# Altium schematic sheet tms320f28388d_core_board_a.SchDoc
size A3; SheetNumber: 1; SheetTotal: 3
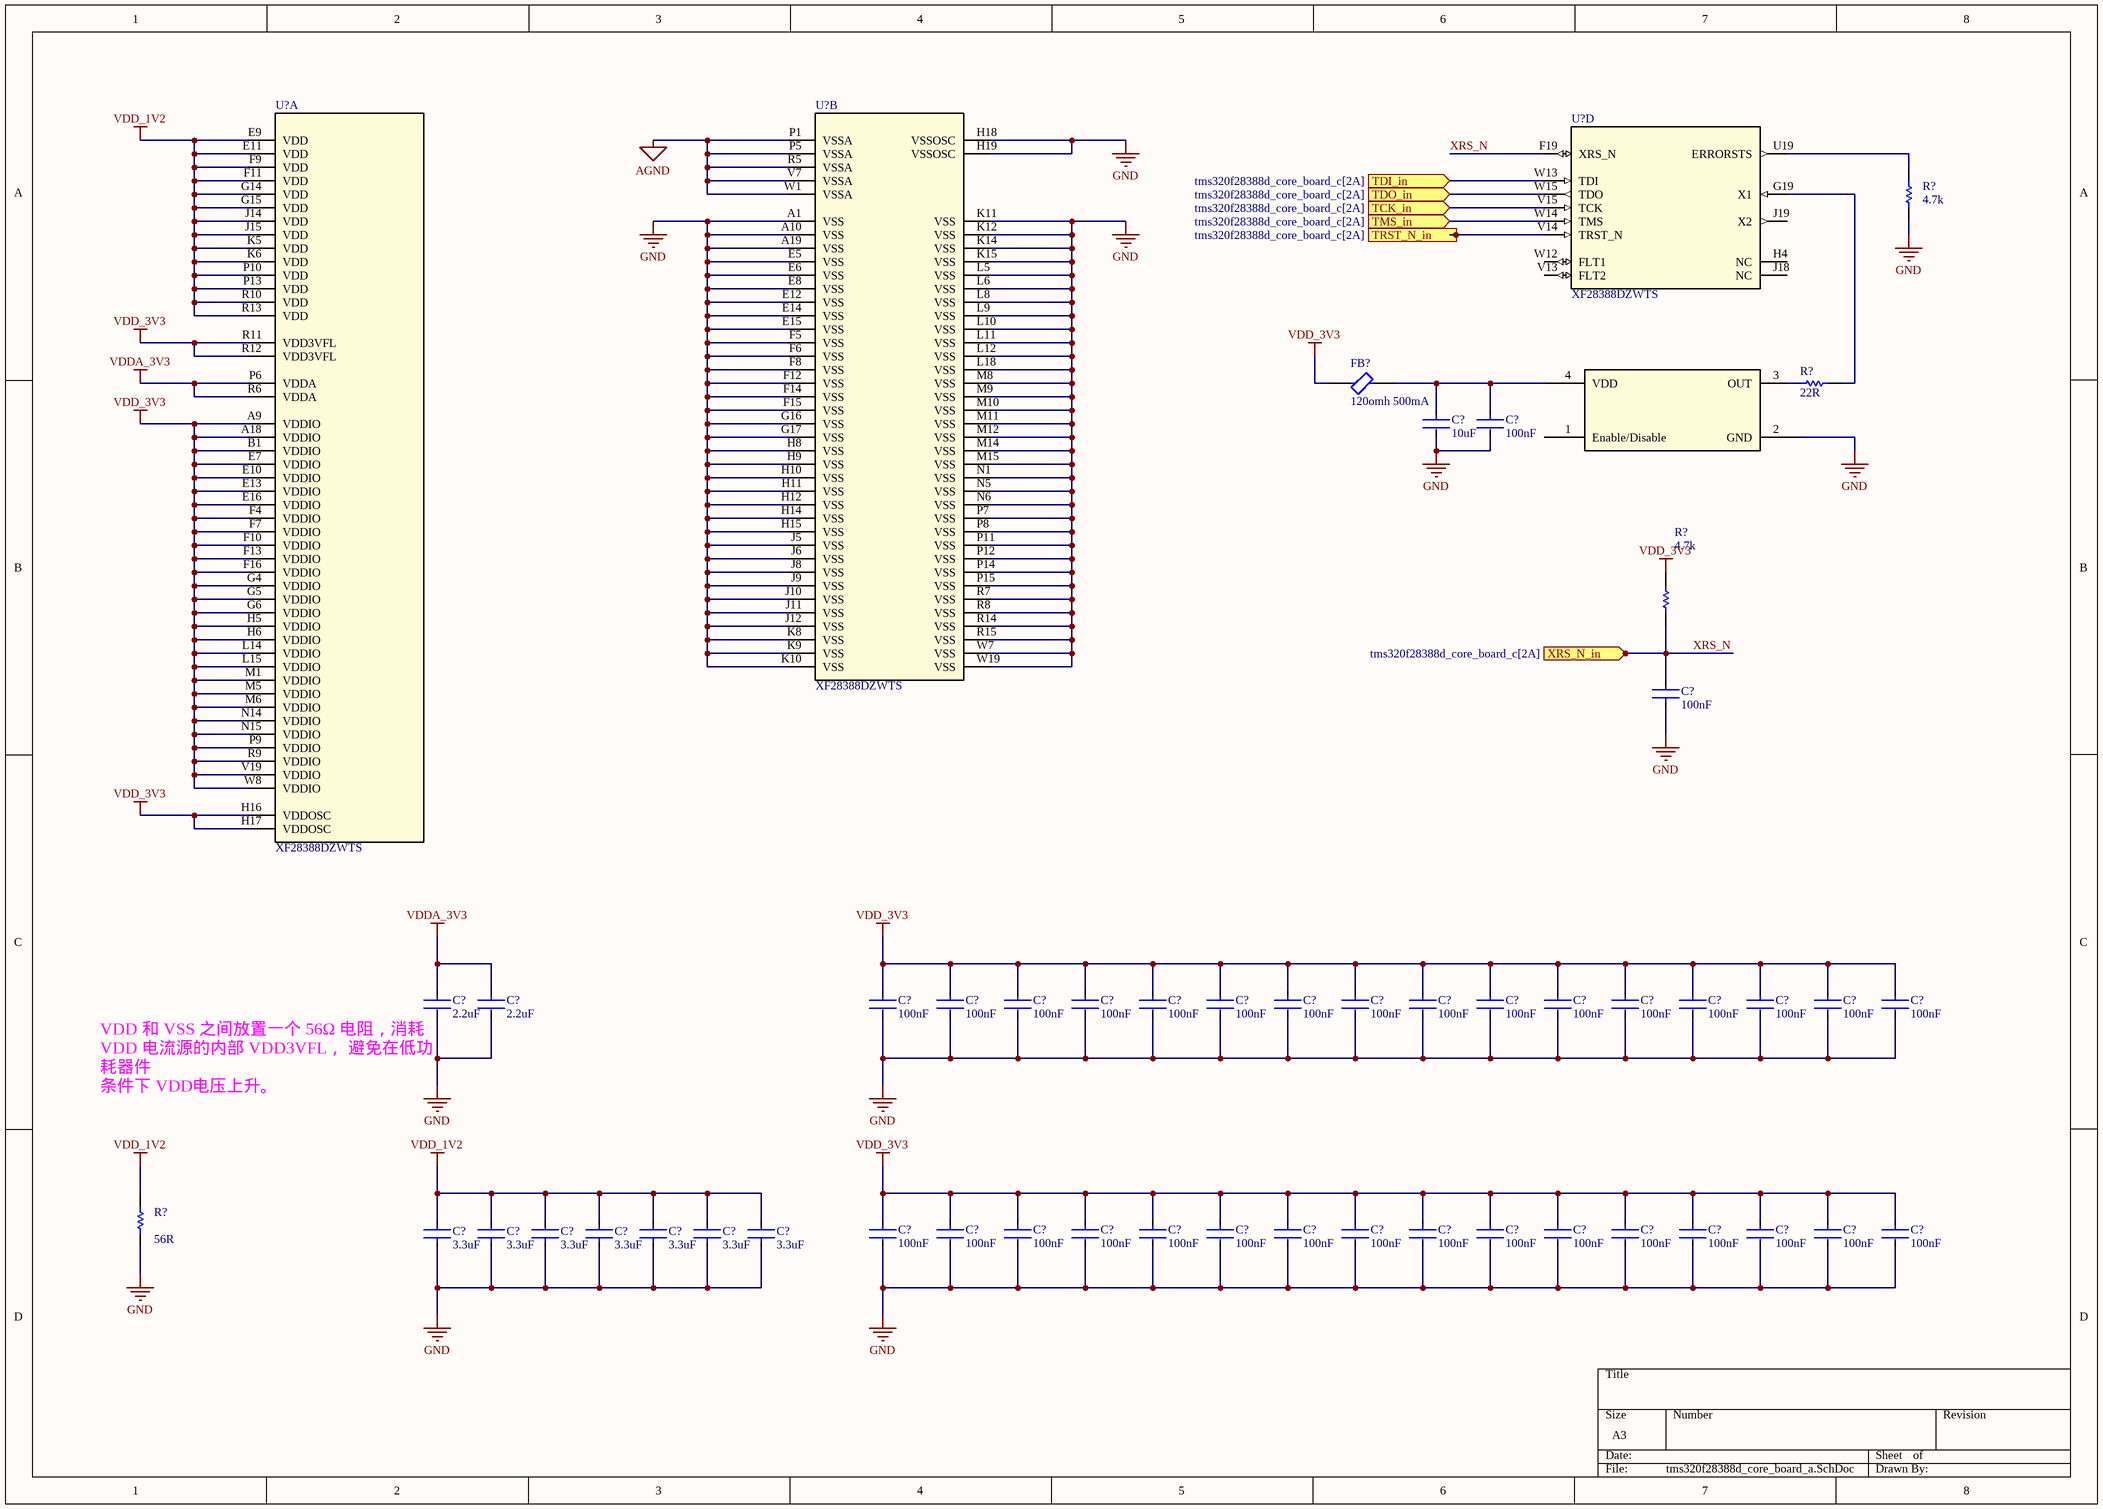
[diagram p0: tms320f28388d_core_board_a.SchDoc]

## Parts
(Parts that share a designator on the sheet are numbered #1, #2 ... from top to bottom, then left to right.)
C?#1  10uF  [FP-CC0402-MFG]
C?#2  100nF  [FP-CC0402-MFG]
C?#3  100nF  [FP-CC0402-MFG]
C?#4  2.2uF  [FP-CC0402-MFG]
C?#5  2.2uF  [FP-CC0402-MFG]
C?#6  100nF  [FP-CC0402-MFG]
C?#7  100nF  [FP-CC0402-MFG]
C?#8  100nF  [FP-CC0402-MFG]
C?#9  100nF  [FP-CC0402-MFG]
C?#10  100nF  [FP-CC0402-MFG]
C?#11  100nF  [FP-CC0402-MFG]
C?#12  100nF  [FP-CC0402-MFG]
C?#13  100nF  [FP-CC0402-MFG]
C?#14  100nF  [FP-CC0402-MFG]
C?#15  100nF  [FP-CC0402-MFG]
C?#16  100nF  [FP-CC0402-MFG]
C?#17  100nF  [FP-CC0402-MFG]
C?#18  100nF  [FP-CC0402-MFG]
C?#19  100nF  [FP-CC0402-MFG]
C?#20  100nF  [FP-CC0402-MFG]
C?#21  100nF  [FP-CC0402-MFG]
C?#22  100nF  [FP-CC0402-MFG]
C?#23  100nF  [FP-CC0402-MFG]
C?#24  100nF  [FP-CC0402-MFG]
C?#25  100nF  [FP-CC0402-MFG]
C?#26  100nF  [FP-CC0402-MFG]
C?#27  100nF  [FP-CC0402-MFG]
C?#28  100nF  [FP-CC0402-MFG]
C?#29  100nF  [FP-CC0402-MFG]
C?#30  100nF  [FP-CC0402-MFG]
C?#31  100nF  [FP-CC0402-MFG]
C?#32  100nF  [FP-CC0402-MFG]
C?#33  100nF  [FP-CC0402-MFG]
C?#34  100nF  [FP-CC0402-MFG]
C?#35  100nF  [FP-CC0402-MFG]
C?#36  100nF  [FP-CC0402-MFG]
C?#37  100nF  [FP-CC0402-MFG]
C?#38  3.3uF  [FP-CC0402-MFG]
C?#39  3.3uF  [FP-CC0402-MFG]
C?#40  3.3uF  [FP-CC0402-MFG]
C?#41  3.3uF  [FP-CC0402-MFG]
C?#42  3.3uF  [FP-CC0402-MFG]
C?#43  3.3uF  [FP-CC0402-MFG]
C?#44  3.3uF  [FP-CC0402-MFG]
FB?  120omh 500mA  [FP-MMZ1005-MFG]
R?#1  4.7k  [FP-RT0402-MFG]
R?#2  22R  [FP-RC0402-0_4-IPC_A]
R?#3  4.7k  [FP-RT0402-MFG]
R?#4  56R  [FP-RT0402-MFG]
U?#1  XF28388DZWTS  [ZWT0337A-MFG]  (part A of 8)
U?#2  XF28388DZWTS  [ZWT0337A-MFG]  (part B of 8)
U?#3  XF28388DZWTS  [ZWT0337A-MFG]  (part D of 8)
X??  ot252020mjba4sl  [OSC-SMD_4P-L2.5-W2.0-BL]  (value not drawn)

## Ports
TCK_in (in, see tms320f28388d_core_board_c[2A]), TDI_in (in, see tms320f28388d_core_board_c[2A]), TDO_in (in, see tms320f28388d_core_board_c[2A]), TMS_in (in, see tms320f28388d_core_board_c[2A]), TRST_N_in (in, see tms320f28388d_core_board_c[2A]), XRS_N_in (in, see tms320f28388d_core_board_c[2A])

## Nets
AGND: U?#2.P1(VSSA) U?#2.P5(VSSA) U?#2.R5(VSSA) U?#2.V7(VSSA) U?#2.W1(VSSA)
GND: C?#1.2 C?#2.2 C?#3.1 C?#4.2 C?#5.2 C?#6.2 C?#7.2 C?#8.2 C?#9.2 C?#10.2 C?#11.2 C?#12.2 C?#13.2 C?#14.2 C?#15.2 C?#16.2 C?#17.2 C?#18.2 C?#19.2 C?#20.2 C?#21.2 C?#22.2 C?#23.2 C?#24.2 C?#25.2 C?#26.2 C?#27.2 C?#28.2 C?#29.2 C?#30.2 C?#31.2 C?#32.2 C?#33.2 C?#34.2 C?#35.2 C?#36.2 C?#37.2 C?#38.1 C?#39.1 C?#40.1 C?#41.1 C?#42.1 C?#43.1 C?#44.1 R?#1.2 R?#4.2 U?#2.A1(VSS) U?#2.A10(VSS) U?#2.A19(VSS) U?#2.E5(VSS) U?#2.E6(VSS) U?#2.E8(VSS) U?#2.E12(VSS) U?#2.E14(VSS) U?#2.E15(VSS) U?#2.F5(VSS) U?#2.F6(VSS) U?#2.F8(VSS) U?#2.F12(VSS) U?#2.F14(VSS) U?#2.F15(VSS) U?#2.G16(VSS) U?#2.G17(VSS) U?#2.H8(VSS) U?#2.H9(VSS) U?#2.H10(VSS) U?#2.H11(VSS) U?#2.H12(VSS) U?#2.H14(VSS) U?#2.H15(VSS) U?#2.H18(VSSOSC) U?#2.H19(VSSOSC) U?#2.J5(VSS) U?#2.J6(VSS) U?#2.J8(VSS) U?#2.J9(VSS) U?#2.J10(VSS) U?#2.J11(VSS) U?#2.J12(VSS) U?#2.K8(VSS) U?#2.K9(VSS) U?#2.K10(VSS) U?#2.K11(VSS) U?#2.K12(VSS) U?#2.K14(VSS) U?#2.K15(VSS) U?#2.L5(VSS) U?#2.L6(VSS) U?#2.L8(VSS) U?#2.L9(VSS) U?#2.L10(VSS) U?#2.L11(VSS) U?#2.L12(VSS) U?#2.L18(VSS) U?#2.M8(VSS) U?#2.M9(VSS) U?#2.M10(VSS) U?#2.M11(VSS) U?#2.M12(VSS) U?#2.M14(VSS) U?#2.M15(VSS) U?#2.N1(VSS) U?#2.N5(VSS) U?#2.N6(VSS) U?#2.P7(VSS) U?#2.P8(VSS) U?#2.P11(VSS) U?#2.P12(VSS) U?#2.P14(VSS) U?#2.P15(VSS) U?#2.R7(VSS) U?#2.R8(VSS) U?#2.R14(VSS) U?#2.R15(VSS) U?#2.W7(VSS) U?#2.W19(VSS) X??.2(GND)
VDD_1V2: C?#38.2 C?#39.2 C?#40.2 C?#41.2 C?#42.2 C?#43.2 C?#44.2 R?#4.1 U?#1.E9(VDD) U?#1.E11(VDD) U?#1.F9(VDD) U?#1.F11(VDD) U?#1.G14(VDD) U?#1.G15(VDD) U?#1.J14(VDD) U?#1.J15(VDD) U?#1.K5(VDD) U?#1.K6(VDD) U?#1.P10(VDD) U?#1.P13(VDD) U?#1.R10(VDD) U?#1.R13(VDD)
VDD_3V3: C?#6.1 C?#7.1 C?#8.1 C?#9.1 C?#10.1 C?#11.1 C?#12.1 C?#13.1 C?#14.1 C?#15.1 C?#16.1 C?#17.1 C?#18.1 C?#19.1 C?#20.1 C?#21.1 C?#22.1 C?#23.1 C?#24.1 C?#25.1 C?#26.1 C?#27.1 C?#28.1 C?#29.1 C?#30.1 C?#31.1 C?#32.1 C?#33.1 C?#34.1 C?#35.1 C?#36.1 C?#37.1 FB?.1 R?#3.1 U?#1.A9(VDDIO) U?#1.A18(VDDIO) U?#1.B1(VDDIO) U?#1.E7(VDDIO) U?#1.E10(VDDIO) U?#1.E13(VDDIO) U?#1.E16(VDDIO) U?#1.F4(VDDIO) U?#1.F7(VDDIO) U?#1.F10(VDDIO) U?#1.F13(VDDIO) U?#1.F16(VDDIO) U?#1.G4(VDDIO) U?#1.G5(VDDIO) U?#1.G6(VDDIO) U?#1.H5(VDDIO) U?#1.H6(VDDIO) U?#1.H16(VDDOSC) U?#1.H17(VDDOSC) U?#1.L14(VDDIO) U?#1.L15(VDDIO) U?#1.M1(VDDIO) U?#1.M5(VDDIO) U?#1.M6(VDDIO) U?#1.N14(VDDIO) U?#1.N15(VDDIO) U?#1.P9(VDDIO) U?#1.R9(VDDIO) U?#1.R11(VDD3VFL) U?#1.R12(VDD3VFL) U?#1.V19(VDDIO) U?#1.W8(VDDIO)
VDDA_3V3: C?#4.1 C?#5.1 U?#1.P6(VDDA) U?#1.R6(VDDA)
TCK_in: U?#3.V15(TCK) ; port TCK_in
TDI_in: U?#3.W13(TDI) ; port TDI_in
TDO_in: U?#3.W15(TDO) ; port TDO_in
TMS_in: U?#3.W14(TMS) ; port TMS_in
TRST_N_in: U?#3.V14(TRST_N) ; port TRST_N_in
XRS_N: C?#3.2 R?#3.2 U?#3.F19(XRS_N) ; port XRS_N_in
NetC?#1_1: C?#1.1 C?#2.1 FB?.2 X??.4(VDD)
NetR?#1_1: R?#1.1 U?#3.U19(ERRORSTS)
NetR?#2_1: R?#2.1 X??.3(OUT)
NetR?#2_2: R?#2.2 U?#3.G19(X1)

Not connected (* = marked no-connect by the designer): U?#3 H4(NC) J18(NC) J19(X2) V13(FLT2) W12(FLT1); X?? 1(Enable/Disable)

## Notes on the sheet
- (near C?#4) VDD 和 VSS 之间放置一个 56Ω 电阻，消耗 VDD 电流源的内部 VDD3VFL， 避免在低功耗器件
  条件下 VDD电压上升。

## Library data of the parts
C?#1 = CL05A106MP5NUNC: CAP CER 10UF 10V X5R 0402; Manufacturer: Samsung; Temperature Coefficient: 15%; Tolerance: 20%; Material: Ceramic; Octopart: https://octopart.com/cl05a106mp5nunc-samsung-22457395; Voltage Rating: 10V; RoHS: TRUE; Value: 10uF; Height: 0.7mm; Digikey Description: CAP CER 10UF 10V X5R 0402; Automotive: No; Package: CL05A106MP5NUNC; Device Class L1: Passive Components; Capacitance: 10uF; Temperature Range High: +85°C; ComponentLink2Description: Datasheet; Device Class L2: Capacitors; Temperature Characteristic: X5R; Manufacturer Part Number: CL05A106MP5NUNC; Temperature: -55°C to +85°C; ComponentLink2URL: http://www.samsungsem.com/kr/support/product-search/mlcc/__icsFiles/afieldfile/2019/05/10/19-CL05A106MP5NUNC.pdf; Device Class L3: Ceramic Capacitors; Category: Cap; Temperature Range Low: -55°C; Ipc Land Pattern Name: CAPC10050X50; Lead Free: Yes
C?#2 C?#3 C?#6-C?#37 = CC0402KRX7R7BB104: CAP CER 0.1UF 16V X7R 0402; Manufacturer: YAGEO; Material: Ceramic; Automotive Grade: NA; Temperature Coefficient: 30ppm/°C; Tolerance: 0.1; Device Class L1: Passive Components; Temperature Range Low: -55°C; Device Class L3: Ceramic Capacitors; Temperature Characteristic: X7R; Ipc Land Pattern Name: CAPC10050X50; Capacitance: 100 nF; Temperature Range High: +125°C; Voltage Rating: 16 V; Temperature: -55°C to +125°C; RoHS: TRUE; Automotive: No; Height: 0.55mm; Device Class L2: Capacitors; Digikey Description: CAP CER 0.1UF 16V X7R 0402; Package: CC0402; Footprint Url: http://www.yageo.com/exep/pages/download/literatures/UPY-C_GEN_24.pdf; ComponentLink2Description: Datasheet; Category: Cap; Lead Free: Yes; Value: 100 nF; Octopart: https://octopart.com/cc0402krx7r7bb104-yageo-42244624; ComponentLink2URL: http://www.yageo.com/documents/recent/UPY-GP_NP0_16V-to-50V_16.pdf; Manufacturer Part Number: CC0402KRX7R7BB104; Mouser Description: 0402 0.1 uF 16 V ±10 % Tolerance X7R SMT Multilayer Ceramic Capacitor
C?#4 C?#5 = CC0402KRX5R6BB225: CAP CER 2.2UF 10V X5R 0402; Manufacturer: YAGEO; Automotive Grade: NA; Temperature Coefficient: 30ppm/°C; Tolerance: 0.1; Material: Ceramic; Automotive: No; Device Class L1: Passive Components; Footprint Url: http://www.yageo.com/exep/pages/download/literatures/UPY-C_GEN_24.pdf; Height: 0.55mm; Temperature Range High: +125°C; Category: Cap; ComponentLink2Description: Datasheet; Lead Free: Yes; Octopart: https://octopart.com/cc0402krx5r6bb225-yageo-30987418; Value: 2.2 uF; Ipc Land Pattern Name: CAPC10050X50; Device Class L3: Ceramic Capacitors; Temperature Characteristic: X5R; Device Class L2: Capacitors; Package: CC0402; RoHS: TRUE; Capacitance: 2.2 uF; Temperature: -55°C to +125°C; Digikey Description: CAP CER 2.2UF 10V X5R 0402; Mouser Description: CC Series 0402 2.2 uF 10 V ±10% Tolerance X5R Multilayer Ceramic Capacitor; Voltage Rating: 10 V; Manufacturer Part Number: CC0402KRX5R6BB225; ComponentLink2URL: http://www.yageo.com/documents/recent/UPY-GP_NP0_16V-to-50V_16.pdf; Temperature Range Low: -55°C
C?#38-C?#44 = C0402C335M7PACTU: Manufacturer: Kemet; Part Number: C0402C335M7PACTU
FB? = MMZ1005S121CT000: Signal Line Ferrite Bead 120Ω @ 100MHz 500mA DCR 220mΩ SMD 0402; DC Resistance (DCR): 250mR; Tolerance: 25%; Impedance: 120R; Series: MMZ; Height: 0.022inch; RoHS Compliant: Yes; Package Quantity: 1; REACH SVHC: No SVHC; Lead Free: Lead Free; Current Rating: 500mA; Packaging: Tape and Reel; Case Code (Imperial): 0402; Width: 0.02inch; Max DC Current: 500mA; Core Material: Ferrite; Case Code (Metric): 1005; Depth: 0.5mm; Case/Package: 0402; Mount: Surface Mount; Length: 0.039inch
R?#1 R?#3 = RT0402BRD074K7L: RES SMD 4.7K OHM 0.1% 1/16W 0402; Manufacturer: Yageo; Voltage Rating: 50V; Temperature Coefficient: 25 ppm/°C; Resistance: 4.7KΩ; Tolerance: 0.001; Power Rating: 0.063W; Value: 4.7KΩ; Device Class L2: Resistors; Composition: Thin Film; Octopart: https://octopart.com/rt0402brd074k7l-yageo-1415343; Mouser Description: Thin Film Resistors 1/16W 4.7K ohm .1% 25ppm; Lead Free: Yes; Height: 0.35mm; Automotive: No; Series: RT; Ipc Land Pattern Name: RESC10050X30; Package: RT0402; Category: Res; Temperature Range High: +155°C; Footprint Url: http://www.yageo.com/exep/pages/download/literatures/PYu-R_Mount_10.pdf; Temperature Range Low: -55°C; Device Class L3: Chip SMD Resistors; Manufacturer Part Number: RT0402BRD074K7L; RoHS: TRUE; ComponentLink2URL: http://www.yageo.com/documents/recent/PYu-RT_1-to-0.01_RoHS_L_9.pdf; Digikey Description: RES SMD 4.7K OHM 0.1% 1/16W 0402; Temperature: -55°C to +155°C; Device Class L1: Passive Components; ComponentLink2Description: Datasheet
R?#2 = CMP-2002-07520-2: Tolerance: 1%; Power Rating: 63mW; Voltage Rating: 50V; Temperature Coefficient: 100ppm/°C; Resistance: 22Ω; Termination: SMD/SMT; Depth: 500µm; Packaging: Tape & Reel; Height: 400µm; Width: 500µm; Case Code (Imperial): 0402; Length: 1mm; Schedule B: 8533210045, 8533210045|8533210045|8533210045|8533210045|8533210045|8533210045|8533210045|8533210045, 8533210045|8533210045|8533210045|8533210045|8533210045|8533210045|8533210045|8533210045|8533210045, 8533210045|8533210045|8533210045|8533210045|8533210045|8533210045|8533210045|8533210045|8533210045|8533210045; Case/Package: 0402; Max Operating Temperature: 155°C; Min Operating Temperature: -55°C; REACH SVHC: Unknown; RoHS: Compliant; Military Standard: Not; Voltage Rating (DC): 50V; Lead Free: Lead Free; Voltage Rating (AC): 50V; Number of Pins: 2; Composition: Thick Film
R?#4 = RT0402BRD0756RL: RES SMD 56 OHM 0.1% 1/16W 0402; Manufacturer: Yageo; Power Rating: 0.063W; Resistance: 56Ω; Tolerance: 0.001; Value: 56Ω; Voltage Rating: 50V; Temperature Coefficient: 25 ppm/°C; Octopart: https://octopart.com/rt0402brd0756rl-yageo-1266468; Footprint Url: http://www.yageo.com/exep/pages/download/literatures/PYu-R_Mount_10.pdf; Mouser Description: Thin Film Resistors 1/16W 56 ohm .1% 25ppm; ComponentLink2URL: http://www.yageo.com/documents/recent/PYu-RT_1-to-0.01_RoHS_L_9.pdf; Category: Res; Temperature Range Low: -55°C; Device Class L2: Resistors; Series: RT; Digikey Description: RES SMD 56 OHM 0.1% 1/16W 0402; Device Class L3: Chip SMD Resistors; Composition: Thin Film; ComponentLink2Description: Datasheet; Temperature: -55°C to +155°C; Manufacturer Part Number: RT0402BRD0756RL; RoHS: TRUE; Lead Free: Yes; Package: RT0402; Temperature Range High: +155°C; Height: 0.35mm; Device Class L1: Passive Components; Ipc Land Pattern Name: RESC10050X30; Automotive: No
U?#1-U?#3 = XF28388DZWTS: C2000 32-bit MCU w/ connectivity manager, 2x C28x+CLA CPU, 1.5 MB flash, FPU64, CLB, ENET, EtherCAT 337-NFBGA -40 to 125; Manufacturer_Name: Texas Instruments; TYPE: TYPE; RefDes: RefDes; Copyright: Copyright (C) 2026 Ultra Librarian. All rights reserved.; Manufacturer_Part_Number: XF28388DZWTS
X?? = OT252020MJBA4SL: 频率:20MHz;常温频差:±10ppm;输出模式:CMOS;工作电压:1.8V~3.3V;工作电流:4mA;频率稳定度:±20ppm;; Manufacturer: YXC(扬兴晶振); AddInBom: yes; ModelId: 6c59bf18646c482ead3932fe5df36485; ModelName: OSC-SMD_4P-L2.5-W2.0-H0.6; ModelTransform: 98.425,78.74,0,0,0,0,0.0005,0,0; Value: 20MHz; Normal temperature Frequency Tolerance: ±10ppm; Output Type: CMOS; Current - Supply: 4mA; Frequency Stability: ±20ppm; Symbol: OT252020MJBA4SL; LCSC Part Name: YSO110TR 20MHZ 1.8V-3.3V ±10PPM -40~85℃（±20PPM) CMOS; SupplierPart: C669067; ManufacturerPart: OT252020MJBA4SL; Supplier Footprint: SMD2520-4P; JLCPCB Part Class: Extended Part; Datasheet: https://item.szlcsc.com/datasheet/OT252020MJBA4SL/699167.html; Supplier: LCSC; ConvertToPcb: yes; FootprintName: OSC-SMD_4P-L2.5-W2.0-BL; Voltage - Supply: 1.8V~3.3V; Operating Temperature: -40℃~+85℃